# EAGLE design musIR-mk-1.0 (EAGLE 7.5.0)
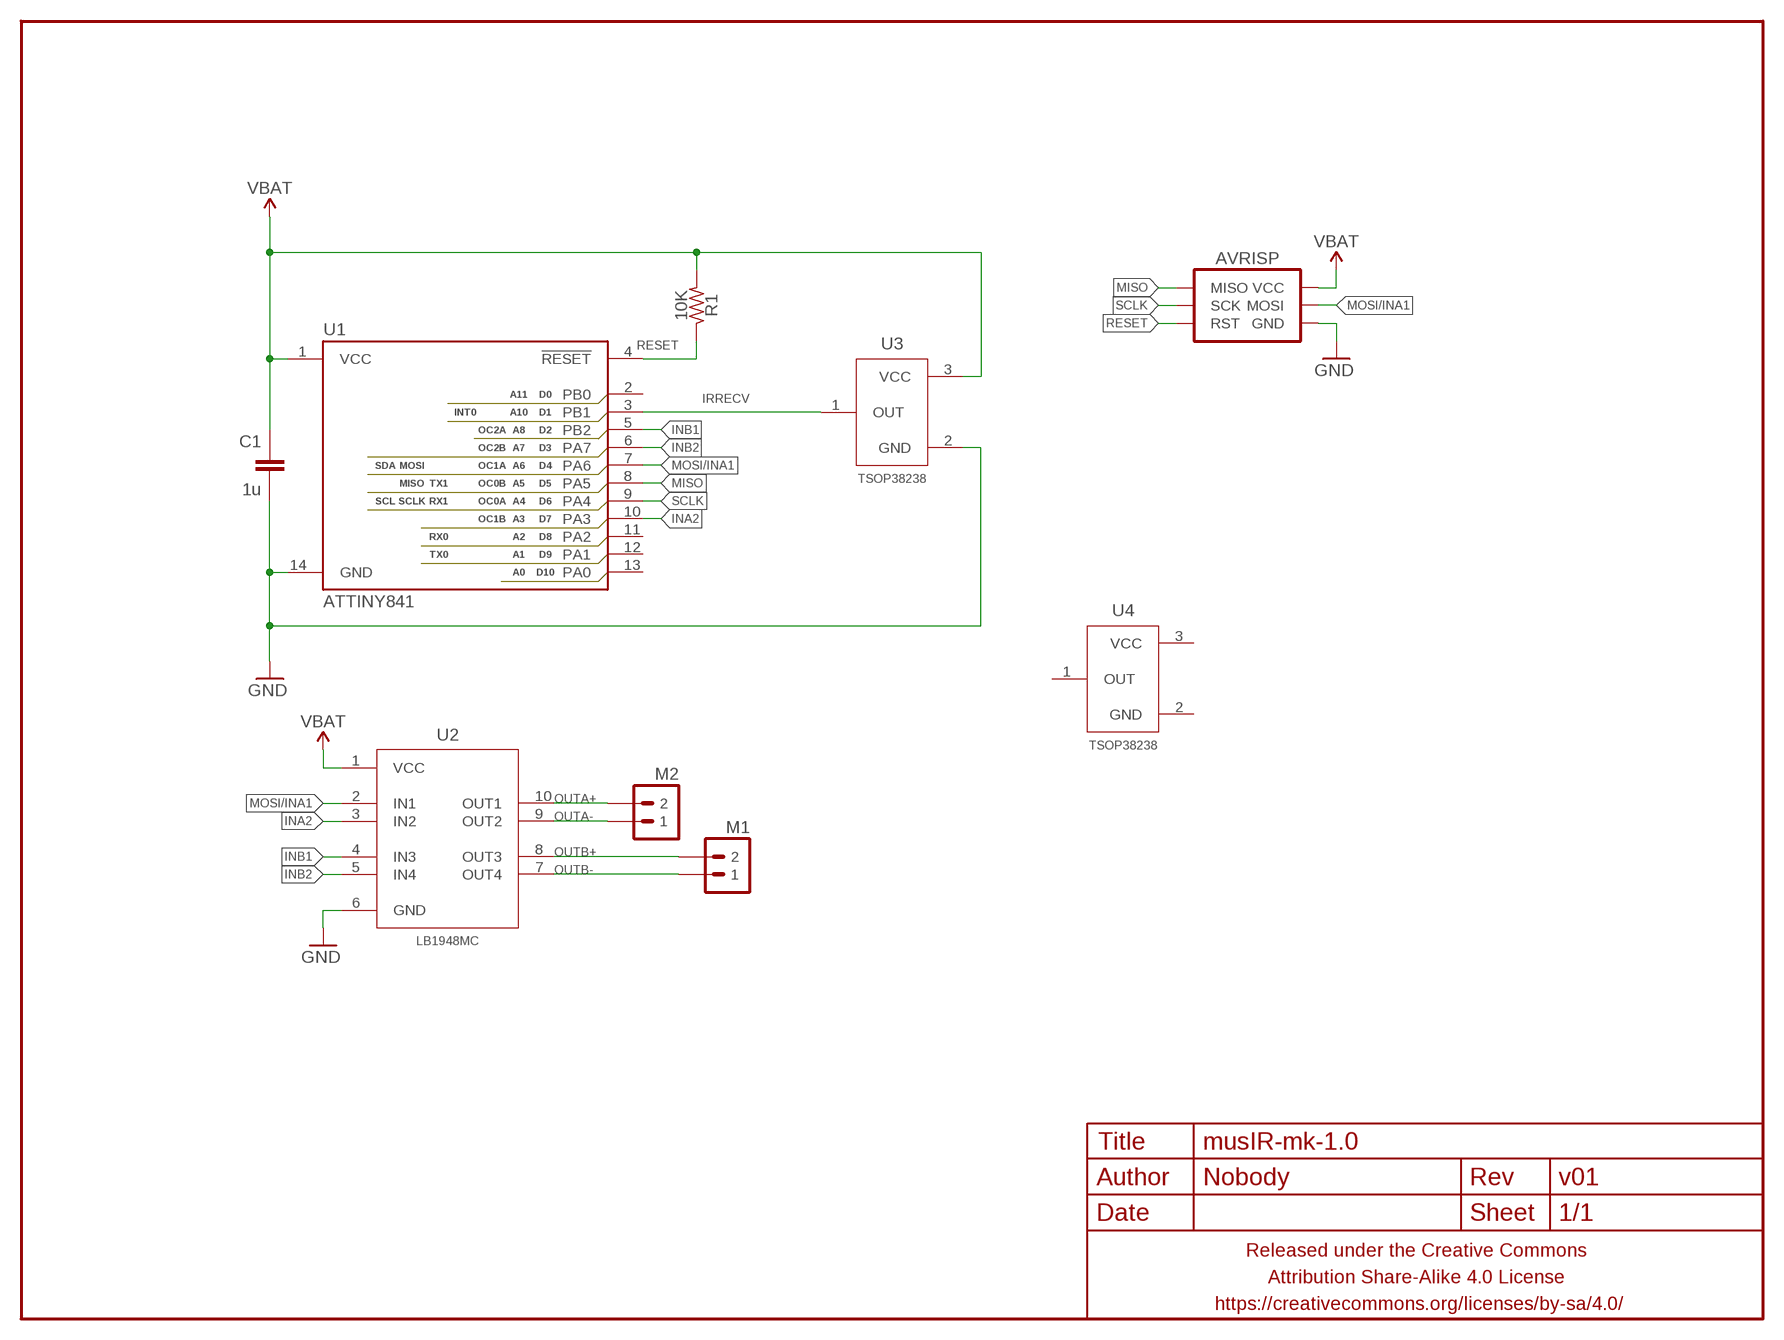
[diagram p0: schematic, sheet 1]

## Parts
AVRISP  AVR_SPI_PRG_6TESTPOINTS  [2X3_TEST_POINTS]
C1  1u  CAPACITOR-CERAMICC0603-TIGHTER  [C0603-TIGHTER]
FRAME1  FRAME-LETTERNO_PACKAGE  [DUMMY]
M1  M02PTH  [1X02]
M2  M02PTH  [1X02]
R1  10K  RESISTORR0603-TIGHTER  [R0603-TIGHTER]
U1  ATTINY841  ATTINY841SOIC14  [SO14]
U2  LB1948MC  LB1948MCMFP10SK  [SO10-NOTREALLY]
U3  TSOP38238  TSOP382__/4__  [TSOP38238]
U4  TSOP38238  TSOP382__/4__  [TSOP38238]

## Nets
GND: AVRISP.6(GND) C1.2 U1.14(GND) U2.6(GND) U3.2(GND)
INA2: U1.10(PA3) U2.3(IN2)
INB1: U1.5(PB2) U2.4(IN3)
INB2: U1.6(PA7) U2.5(IN4)
IRRECV: U1.3(PB1) U3.1(OUT)
MISO: AVRISP.1(MISO) U1.8(PA5)
MOSI/INA1: AVRISP.4(MOSI) U1.7(PA6) U2.2(IN1)
OUTA+: M2.2 U2.10(OUT1)
OUTA-: M2.1 U2.9(OUT2)
OUTB+: M1.2 U2.8(OUT3)
OUTB-: M1.1 U2.7(OUT4)
RESET: AVRISP.5(RST) R1.1 U1.4(!RESET)
SCLK: AVRISP.3(SCK) U1.9(PA4)
VBAT: AVRISP.2(VCC) C1.1 R1.2 U1.1(VCC) U2.1(VCC) U3.3(VCC)
Unconnected: U1.2(PB0) U1.11(PA2) U1.12(PA1) U1.13(PA0) U4.1(OUT) U4.2(GND) U4.3(VCC)

## Library data of the parts
AVRISP = a_parts:AVR_SPI_PRG_6: AVR ISP 6 Pin This is the reduced ISP connector for AVR programming. Common on Arduino. This footprint will take up less PCB space and can be used with a 10-pin to 6-pin adapter such as SKU: BOB-08508 **Special note about "TEST_POINT" package. The stop mask is on the top side, so if you want your programming test points to be on the bottom of your board, make sure to place this package on the bottom side of the board. This also ensure that the orientation to program from the bottom side will be correct.
C1 = a_parts:CAPACITOR-CERAMIC: CAPACITOR, European symbol
FRAME1 = a_parts:FRAME-LETTER: Schematic Frame Standard 8.5x11 US Letter frame; DESIGNER: Nobody; VERSION: v01
M1 M2 = a_parts:M02: Standard 2-pin 0.1" header. Use with - straight break away headers ( PRT-00116) - right angle break away headers (PRT-00553) - swiss pins (PRT-00743) - machine pins (PRT-00117) - female headers (PRT-00115) Molex polarized connector foot print use with: PRT-08233 with associated crimp pins and housings. 2.54_SCREWTERM for use with PRT-10571. 3.5mm Screw Terminal footprints for PRT-08084 5mm Screw Terminal footprints for use with PRT-08433
R1 = a_parts:RESISTOR: RESISTOR, American symbol
U1 = a_parts:ATTINY841
U2 = a_parts:LB1948MC
U3 U4 = a_parts:TSOP382__/4__

## Board
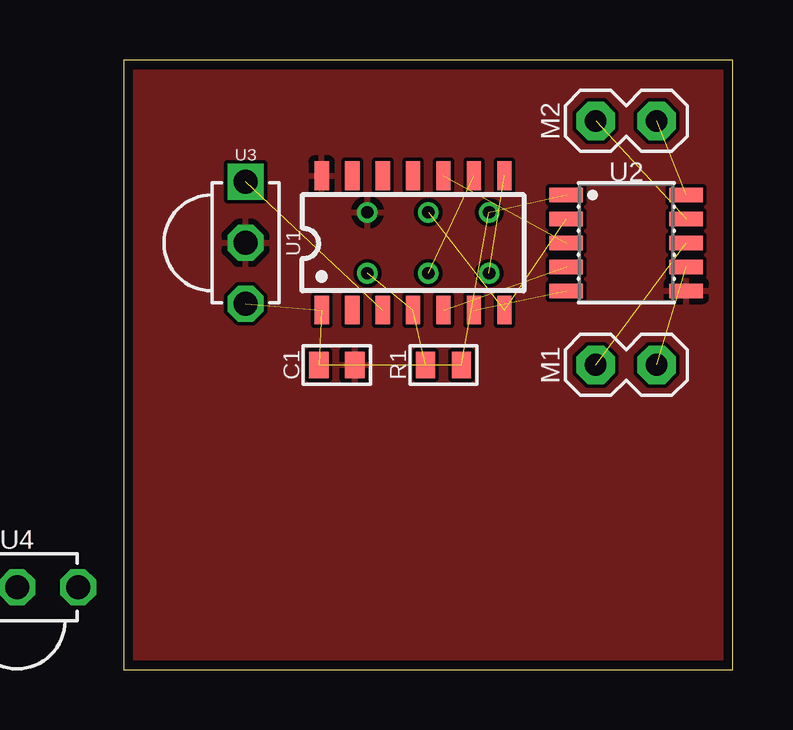
[diagram p1: board, top side]
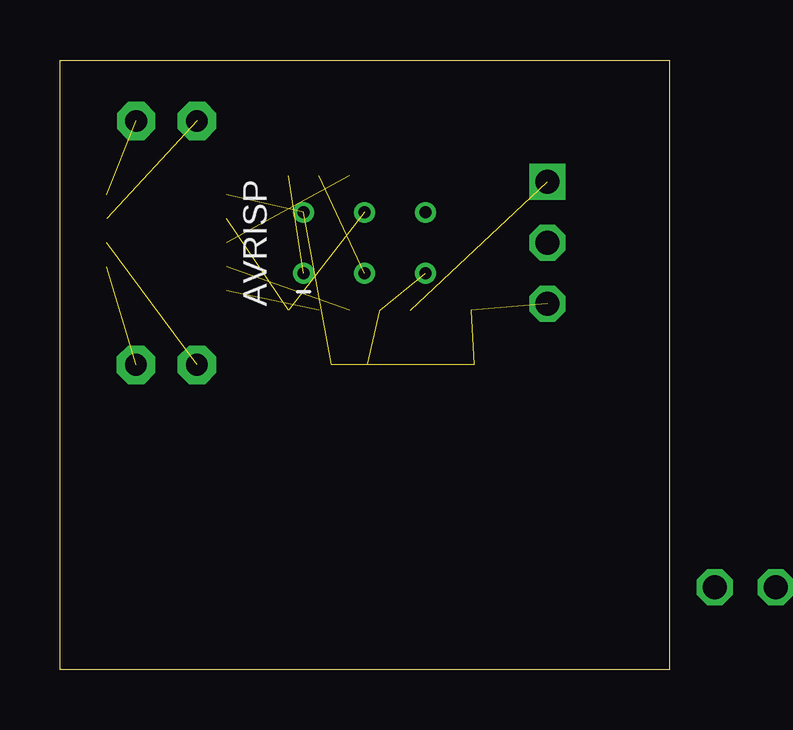
[diagram p2: board, bottom side, seen from below]

Size 25.4 x 25.4 mm. Coordinates in mm from the lower left corner, seen from the top.
Outline: 0,0 25.4,0 25.4,25.4 0,25.4 0,0
Copper layers (1*16): Top 0.0356mm / dielectric 1.5011mm / Bottom 0.0356mm
Design rules "LaenPCBOrder2": minimum track width 6mil, minimum drill 13mil, track to track 6mil, track to pad 6mil, pad to pad 6mil, via to via 6mil, smd to smd 6mil, copper to edge 15mil, drill to drill 6mil, minimum pad ring 7mil, minimum via ring 7mil, stop-mask expansion 3mil, vias tented up to drill 20mil, thermal gap 10mil

### Footprints (pad centres in the part's own frame; a part is rotated, then mirrored left to right if it is on the bottom)
2X3_TEST_POINTS = drill 0.508: 1 -2.54,-1.27; 2 -2.54,1.27; 3 0,-1.27; 4 0,1.27; 5 2.54,-1.27; 6 2.54,1.27
C0603-TIGHTER = smd 0.8 x 1.1: 1 -0.75,0; 2 0.75,0
1X02 = drill 0.9 pad 1.6 octagon: 1 0,0; 2 2.54,0
R0603-TIGHTER = smd 0.8 x 1.1: 1 -0.75,0; 2 0.75,0
SO14 = smd 0.6 x 1.2: 1 -3.81,-2.8; 2 -2.54,-2.8; 3 -1.27,-2.8; 4 0,-2.8; 5 1.27,-2.8; 6 2.54,-2.8; 7 3.81,-2.8; 8 3.81,2.8; 9 2.54,2.8; 10 1.27,2.8; 11 0,2.8; 12 -1.27,2.8; 13 -2.54,2.8; 14 -3.81,2.8
SO10-NOTREALLY = smd 0.6 x 1.4: 1 -2,-2.5; 2 -1,-2.5; 3 0,-2.5; 4 1,-2.5; 5 2,-2.5; 6 2,2.5; 7 1,2.5; 8 0,2.5; 9 -1,2.5; 10 -2,2.5
TSOP38238 = drill 1 square: 1 -2.54,0 | drill 1 octagon: 2 0,0; 3 2.54,0

### Placement (x,y rotation side)
AVRISP  12.7,17.78 0 bottom
C1  8.89,12.7 0 top
FRAME1  0,0 0 top
M1  22.23,12.7 180 top
M2  19.68,22.86 0 top
R1  13.34,12.7 0 top
U1  12.06,17.78 0 top
U2  20.95,17.78 270 top
U3  5.08,17.78 270 top
U4  -4.45,3.43 0 top

### Tracks (layer width: path | path; a pad name or v marks a point on that pad's centre or on a via)
GND
  pour Top (rank 6): 0,0 25.4,0 25.4,25.4 0,25.4
INA2  (1 unrouted)
INB1  (1 unrouted)
INB2  (1 unrouted)
IRRECV  (1 unrouted)
MISO  (1 unrouted)
MOSI/INA1  (2 unrouted)
OUTA+  (1 unrouted)
OUTA-  (1 unrouted)
OUTB+  (1 unrouted)
OUTB-  (1 unrouted)
RESET  (2 unrouted)
SCLK  (1 unrouted)
VBAT  (5 unrouted)